# Altium schematic sheet RF_Xbee.SchDoc
size A4
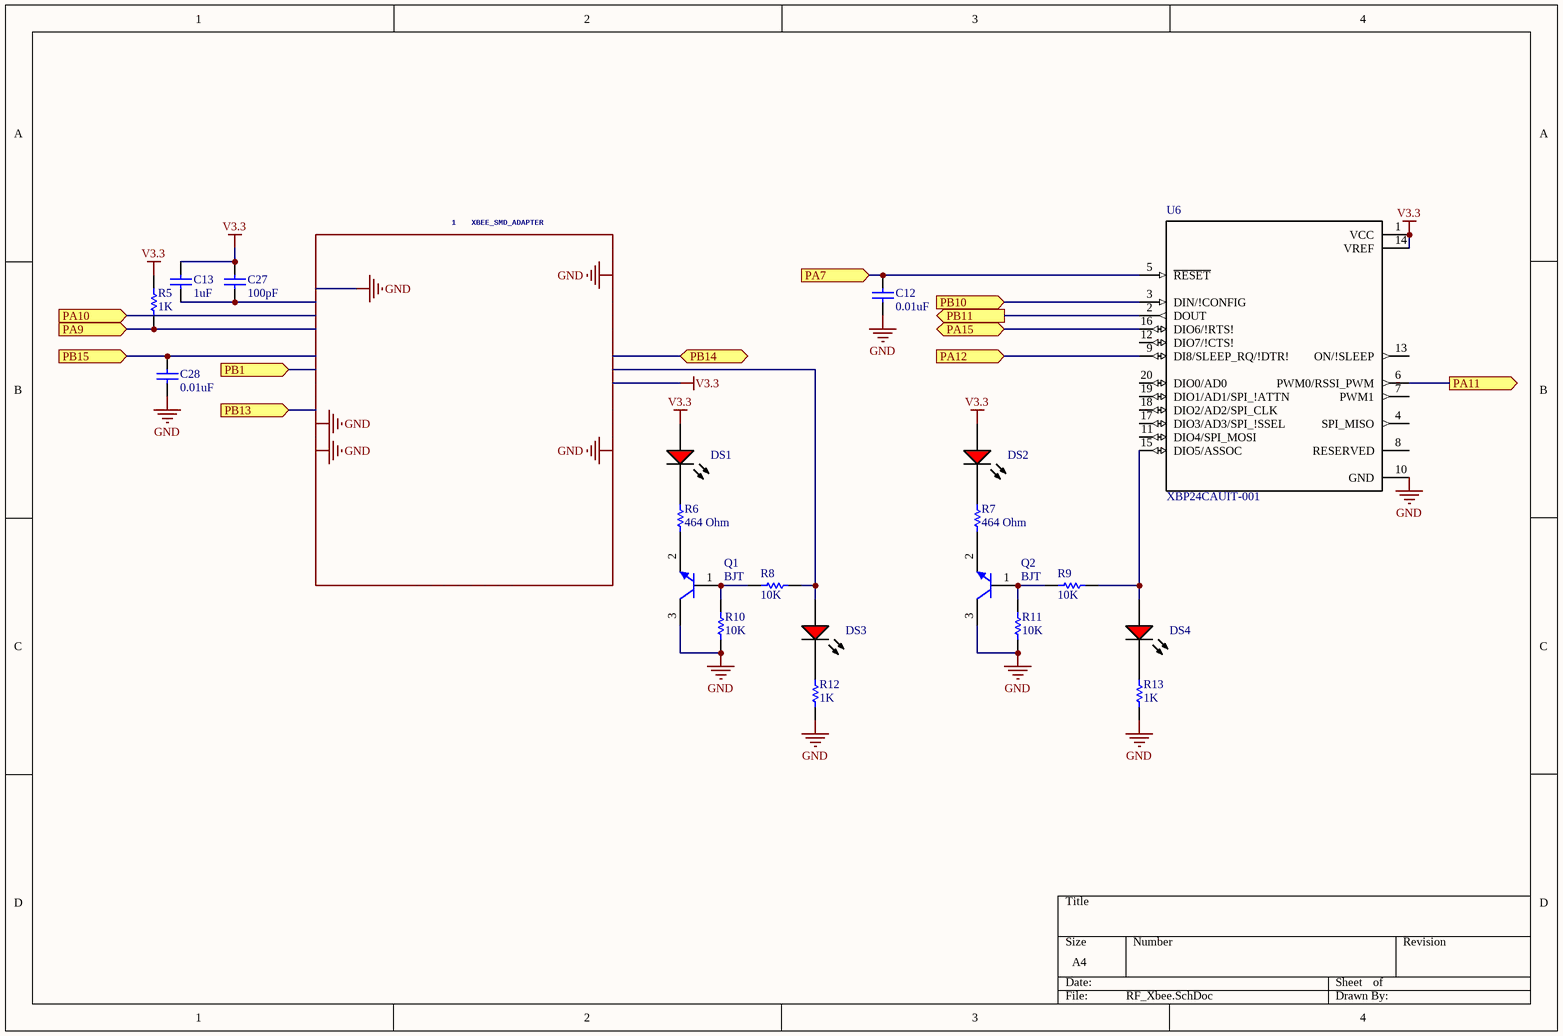
[diagram p0: RF_Xbee.SchDoc]

## Parts
1  XBEE_SMD_ADAPTER  [XBEE_SMD_ADAPTER]
C12  0.01uF  [CAPC1206(3216)170_M]
C13  1uF  [CAPC3216X180X50ML20T25]
C27  100pF  [CAPC2013X88X50ML20T25]
C28  0.01uF  [CAPC1206(3216)170_M]
DS1  HSMH-C150  [AVAG-HSMX-C150_V]  (value not drawn)
DS2  HSMH-C150  [AVAG-HSMX-C150_V]  (value not drawn)
DS3  HSMH-C150  [AVAG-HSMX-C150_V]  (value not drawn)
DS4  HSMH-C150  [AVAG-HSMX-C150_V]  (value not drawn)
Q1  BJT  [ONSC-SOT-23-3-318-08_V]
Q2  BJT  [ONSC-SOT-23-3-318-08_V]
R5  1K  [RESC2013X50X30NL20T20]
R6  464 Ohm  [RESC3216X70X50NL05T20]
R7  464 Ohm  [RESC3216X70X50NL05T20]
R8  10K  [RESC1609X50X30NL8T20]
R9  10K  [RESC1609X50X30NL8T20]
R10  10K  [RESC1609X50X30NL8T20]
R11  10K  [RESC1609X50X30NL8T20]
R12  1K  [RESC2013X50X30NL20T20]
R13  1K  [RESC2013X50X30NL20T20]
U6  XBP24CAUIT-001  [*MODULE_XBP24CAUIT-001]

## Ports
PA7 (in), PA9 (in), PA10 (in), PA11 (out), PA12 (in), PA15 (bidir), PB1 (in), PB10 (in), PB11 (out), PB13 (in), PB14 (bidir), PB15 (in)

## Nets
GND: 1.1(P$1) 1.11(P$11) 1.13(P$13) 1.22(P$22) 1.35(P$35) C12.1 C28.1 Q1.3(C) Q2.3(C) R10.2 R11.2 R12.1 R13.1 U6.10(GND)
V3.3: 1.27(P$27) C13.2 C27.2 DS1.1(A) DS2.1(A) R5.2 U6.1(VCC) U6.14(VREF)
PA7: C12.2 U6.5(~{RESET}) ; port PA7
PA9: 1.4(P$4) R5.1 ; port PA9
PA10: 1.3(P$3) ; port PA10
PA11: U6.6(PWM0/RSSI_PWM) ; port PA11
PA12: U6.9(DI8/SLEEP_RQ/!DTR!) ; port PA12
PA15: U6.16(DIO6/!RTS!) ; port PA15
PB1: 1.7(P$7) ; port PB1
PB10: U6.3(DIN/!CONFIG) ; port PB10
PB11: U6.2(DOUT) ; port PB11
PB13: 1.10(P$10) ; port PB13
PB14: 1.29(P$29) ; port PB14
PB15: 1.6(P$6) C28.2 ; port PB15
Net1_2: 1.2(P$2) C13.1 C27.1
Net1_28: 1.28(P$28) DS3.1(A) R8.1
NetDS1_2: DS1.2(K) R6.2
NetDS2_2: DS2.2(K) R7.2
NetDS3_2: DS3.2(K) R12.2
NetDS4_1: DS4.1(A) R9.1 U6.15(DIO5/ASSOC)
NetDS4_2: DS4.2(K) R13.2
NetQ1_1: Q1.1(B) R8.2 R10.1
NetQ1_2: Q1.2(E) R6.1
NetQ2_1: Q2.1(B) R9.2 R11.1
NetQ2_2: Q2.2(E) R7.1

Not connected (* = marked no-connect by the designer): 1 5(P$5) 8(P$8) 9(P$9) 12(P$12) 14(P$14) 15(P$15) 16(P$16) 17(P$17) 18(P$18) 19(P$19) 20(P$20) 21(P$21) 23(P$23) 24(P$24) 25(P$25) 26(P$26) 30(P$30) 31(P$31) 32(P$32) 33(P$33) 34(P$34) 36(P$36) 37(P$37); U6 4(SPI_MISO) 7(PWM1) 8(RESERVED) 11(DIO4/SPI_MOSI) 12(DIO7/!CTS!) 13(ON/!SLEEP) 17(DIO3/AD3/SPI_!SSEL) 18(DIO2/AD2/SPI_CLK) 19(DIO1/AD1/SPI_!ATTN) 20(DIO0/AD0)

## Library data of the parts
1 = XBEE_SMD_ADAPTER: GateName_1: G$1; SymbolName_1: XBEE_SMD_ADAPTER; LibraryName: UBCSolar; DeviceSetName: XBEE_SMD_ADAPTER; Package: XBEE_SMD_ADAPTER
C12 C28 = CMP-1037-03508-1: CAP 10nF 50V ±5% 1206 (3216 Metric) Thickness 1.7mm SMD; Tolerance: Â±5%; Case-EIA: 1206; Case-Metric: 3216; Technology: SMT; Rated Voltage: 50 V; Value: 10nF; Max Thickness: 1.7 mm
C13 = CMP-2000-04991-1: Chip Capacitor, 1 uF, +/- 10%, 25 V, -55 to 125 degC, 1206 (3216 Metric), RoHS, Tape and Reel; Manufacturer: Kemet; Temperature Coefficient / Code: +/-15%; Dielectric: X7R; Voltage Rating DC: 25V; Capacitance - nF: 1000nF; Class: Class1; Case Length: 3.2mm; Type: SMDMLCCX7R6.3-250VDCCommericalGrade; Case Width: 1.6mm; Product: GeneralTypeMLCCs; Capacitance: 1uF; Datasheet URL: https://ciiva.com/datasheet-click-18194173?src=ciiva&sig=6daff8c4; Operating Temperature Range: -55Cto+125C; Series: C1206C; RoHS: Details; Product Category: MultilayerCeramicCapacitorsMLCC-SMD/SMT; Manufacturer URL: http://www.kemet.com/; Minimum Operating Temperature: -55C; Dimensions: 1.6mmWx3.2mmLx1.6mmH; Termination Style: SMD/SMT; Brand: Kemet; Packaging: Reel; Package / Case: 1206(3216metric); Case Code - mm: 3216; Datasheet Version: Jul-14; Factory Pack Quantity: 2000; Package Description: 2-Pin Surface Mount Device, Body 3.2 x 1.6 mm; Tolerance: 10%; Package Reference: 1206; Case Height: 1.6mm; Case Code - in: 1206; Maximum Operating Temperature: +125C; Voltage Rating: 25V
C27 = CMP-2007-00223-1: Manufacturer: Kemet; Part Number: C0805C101J2GACTU
DS1-DS4 = CMP-2000-06426-1: LED Uni-Color Red, 65 mW, 25 mA, -40 to 85 degC, 2-Pin SMD, RoHS, Tape and Reel; Manufacturer: Avago; Product Height (mm): 1.1mm; Power Dissipation: 78W; Product Length (mm): 3.2mm; Forward Voltage: 2.6V; Luminous Intensity: 17mcd; DELETED: Compliant; Shape Type: Rectangular; Peak Wavelength: 660nm; Main Category: ChipLED; Dominant Wave Length: 639nm; Rad Hardened: No; Lens Type: ColorlessDiffused; Product Depth (mm): 1.6mm; Reverse Voltage: 5V; Forward Current: 25mA; Chip Material: GaAlAs; Test Current (It): 20mA; Viewing Angle: 170deg; Number of  Elements: 1; Type: Uni-Color; Package Reference: HSMX-C150; Package Description: 2-Pin Surface Mount Device, Body 3.2 x 1.6 mm; Operating Temp Range: -40Cto85C; Mounting: SurfaceMount; Emitting Color: Red; Pin Count: 2; Operating Temperature Classification: Industrial; Datasheet URL: http://media.digikey.com/pdf/Data%20Sheets/Avago%20PDFs/HSMz-Czzz.pdf; Package Type: ChipLed; Mounting Technology: SurfaceMount; High Brightness: No; Lens Dimensions: 2x1.6x0.6mm; Manufacturer URL: http://www.avagotech.com/; Lum Intensity: 17mcd; Datasheet Version: 03/2012; Packaging: TapeandReel
Q1 Q2 = CMP-1048-00631-1: General Purpose Transistor, NPN Silicon, 3-Pin SOT-23, Pb-Free, Tape and Reel; Manufacturer: On Semiconductor; PartNumber: MMBT3904LT1G; IC Continuous (A): 0.2; fT Min (MHz): 300; ComponentLink2Description: Datasheet; Polarity: NPN; PackageDescription: 3-Pin Small Outline Transistor, Body 2.92 x 1.3 mm, Pitch 0.95 mm; ComponentLink2URL: http://www.onsemi.cn/pub_link/Collateral/MMBT3904LT1-D.PDF; DatasheetVersion: Rev. 12; Mounting Technology: Surface Mount; ComponentLink1URL: http://www.onsemi.com/; ComponentLink3Description: Package Specification; ComponentLink1Description: Manufacturer URL; PackageVersion: Rev. AP, 11/2009; PackageReference: SOT-23-3-318-08; Packing: Tape and Reel; ComponentLink3URL: http://www.onsemi.cn/pub_link/Collateral/318-08.PDF; RoHS: TRUE
R5 R12 R13 = CMP-2001-03595-1: Part Number: CRCW08051K00FKEA; Manufacturer: Vishay Dale
R6 R7 = CMP-2003-00383-1: Part Number: ERJ-8ENF4640V; Manufacturer: Panasonic
R8-R11 = CMP-1666-00005-4: Chip Resistor, 10 KOhm, +/- 1%, 100 mW, -55 to 155 degC, 0603 (1608 Metric), RoHS, Tape and Reel; Manufacturer: Vishay Semiconductor; Voltage Rating: 75 V; Max Operating Temperature: 155 degC; PackageDescription: 2-Pin Surface Mount Device, Body 1.575 x 0.85 mm; ComponentLink1Description: Manufacturer URL; RoHSCompliant: true; PackageReference: 0603; REACH SVHC: Unknown; Length: 1.55 mm; DatasheetVersion: 06/2012; Packaging: Tape and Reel; Min Operating Temperature: -55 degC; Mounting Technology: Surface Mount; ComponentLink2URL: https://datasheet.ciiva.com/11809/0900766b80d98afc-11809037.pdf; Height: 0.45 mm; ComponentLink2Description: Datasheet; Package Quantity: 5000; ComponentLink1URL: http://www.vishay.com/
U6 = XBP24CAUIT-001: 802.15.4 Transceiver Module 2.4GHz Antenna Not Included, U.FL Through Hole; MF: Digi International; SnapEDA_Link: https://www.snapeda.com/parts/XBP24CAUIT-001/Digi%20International/view-part/1219456/?ref=snap; Availability: Unavailable; Price: None; Package: Module Digi International; MP: XBP24CAUIT-001; Value: *